# Altium project MachXO3_Breakout.PrjPcb
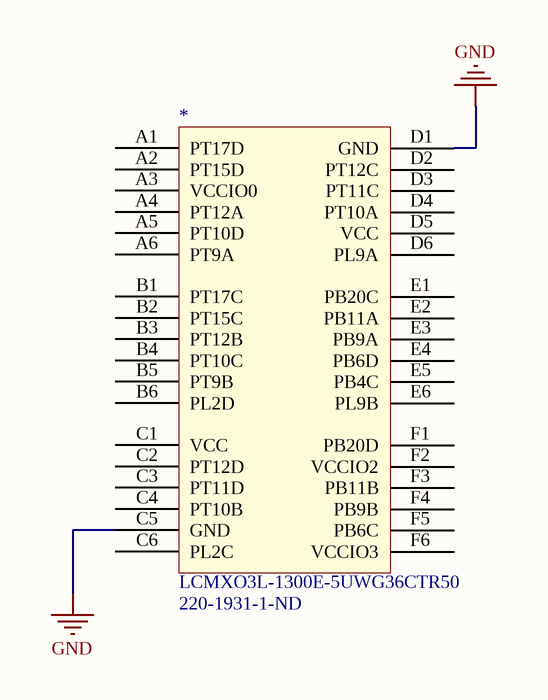
[diagram p0: MachXO3_Breakout.SchDoc]
1 sheet, 1 parts. Net scope: global (net labels, ports and power ports of the same name join across sheets).
Board file: MachXO3_Breakout.PcbDoc

## Sheet MachXO3_Breakout.SchDoc
size A4

### Parts
*  LCMXO3L-1300E-5UWG36CTR50  Supplier Part Number 1: 220-1931-1-ND  [WLCSP36]

### Nets
GND: *.C5(GND) *.D1(GND)

Not connected (* = marked no-connect by the designer): * A1(PT17D) A2(PT15D) A3(VCCIO0) A4(PT12A) A5(PT10D) A6(PT9A) B1(PT17C) B2(PT15C) B3(PT12B) B4(PT10C) B5(PT9B) B6(PL2D) C1(VCC) C2(PT12D) C3(PT11D) C4(PT10B) C6(PL2C) D2(PT12C) D3(PT11C) D4(PT10A) D5(VCC) D6(PL9A) E1(PB20C) E2(PB11A) E3(PB9A) E4(PB6D) E5(PB4C) E6(PL9B) F1(PB20D) F2(VCCIO2) F3(PB11B) F4(PB9B) F5(PB6C) F6(VCCIO3)

### Library data of the parts
* = LCMXO3L-1300E-5UWG36CTR50: Supplier 1: Digi-Key